# Altium schematic sheet Signal_distribution.SchDoc: =ProjectName
size 420 x 297 mm; Author: SBH; CompanyName: WUT; DrawnBy: SBH; Organization: ISE-WUT; Address1: Warsaw Univeristy of Technology; Address2: Nowowiejska 15/19; DocumentNumber: 6; Revision: -; SheetNumber: 6; SheetTotal: 12; EDA_Number: ARTIQ; Projet: eRTM15 Baikal; ModifiedBy: -; CreateDate: XX/XX/XXXX; CheckedDate: -; Title2: Signal_distribution.SchDoc; DivGrp: ISE; Designer: SBH; ModifiedDate: -; ProjectName: eRTM15 Baikal
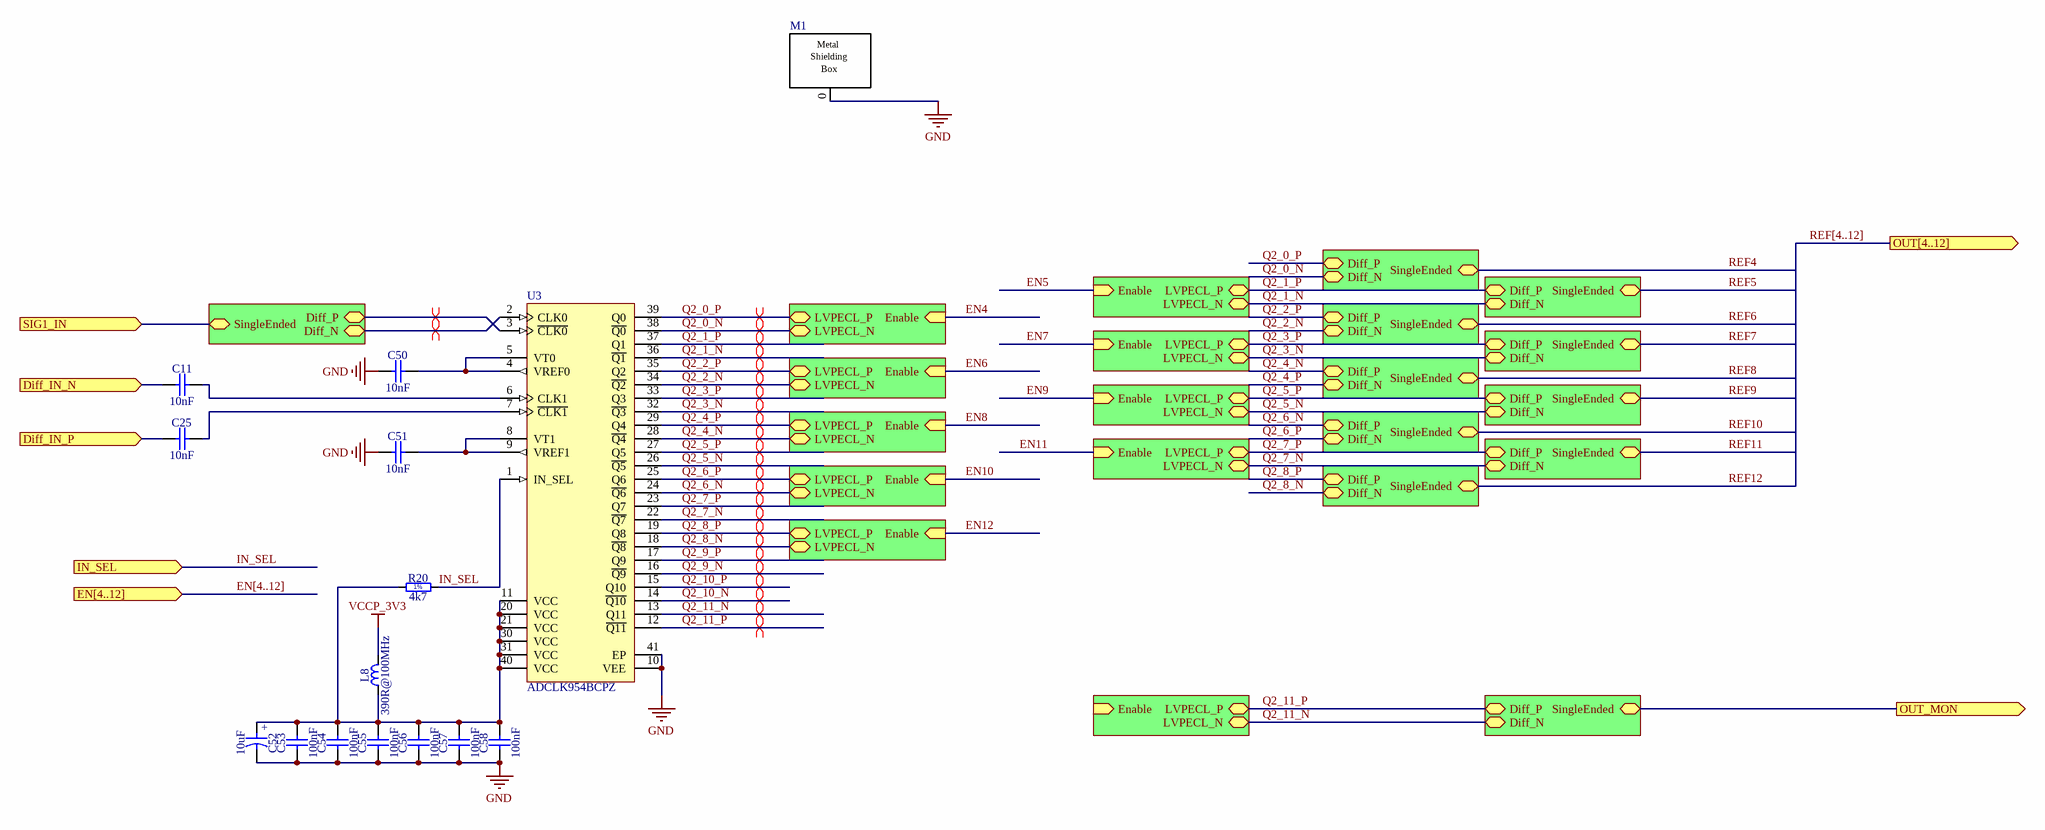
[diagram p0: Signal_distribution.SchDoc]

## Parts
C11  10nF  [CAPC1005X55N]
C25  10nF  [CAPC1005X55N]
C50  10nF  [CAPC1005X55N]
C51  10nF  [CAPC1005X55N]
C52  10uF  [CAPMP3216X180N]
C53  100nF  [CAPC1005X55N]
C54  100nF  [CAPC1005X55N]
C55  100nF  [CAPC1005X55N]
C56  100nF  [CAPC1005X55N]
C57  100nF  [CAPC1005X55N]
C58  100nF  [CAPC1005X55N]
L8  390R@100MHz  [INDC1608X95N]
M1  Shield  [BMI-S-202-F]  (value not drawn)
R20  4k7  [RESC1005X40N]
U3  ADCLK954BCPZ  [ADI-CP-40-8_M]

## Sub-sheets
U_Diff2SE = Diff2SE.SchDoc: Diff_P, Diff_N, SingleEnded
U_Diff2SE = Diff2SE.SchDoc: Diff_P, Diff_N, SingleEnded
U_Diff2SE = Diff2SE.SchDoc: Diff_P, Diff_N, SingleEnded
U_Diff2SE = Diff2SE.SchDoc: Diff_P, Diff_N, SingleEnded
U_Diff2SE = Diff2SE.SchDoc: Diff_P, Diff_N, SingleEnded
U_Diff2SE = Diff2SE.SchDoc: Diff_P, Diff_N, SingleEnded
U_Diff2SE = Diff2SE.SchDoc: Diff_P, Diff_N, SingleEnded
U_Diff2SE = Diff2SE.SchDoc: Diff_P, Diff_N, SingleEnded
U_Diff2SE = Diff2SE.SchDoc: Diff_P, Diff_N, SingleEnded
U_Diff2SE = Diff2SE.SchDoc: Diff_P, Diff_N, SingleEnded
U_Diff2SE = Diff2SE.SchDoc: Diff_P, Diff_N, SingleEnded
U_LvpeclTermWithCtrl = LvpeclTermWithCtrl.SchDoc: LVPECL_P (bidir), LVPECL_N (bidir), Enable (in)
U_LvpeclTermWithCtrl = LvpeclTermWithCtrl.SchDoc: LVPECL_P (bidir), LVPECL_N (bidir), Enable (in)
U_LvpeclTermWithCtrl = LvpeclTermWithCtrl.SchDoc: LVPECL_P (bidir), LVPECL_N (bidir), Enable (in)
U_LvpeclTermWithCtrl = LvpeclTermWithCtrl.SchDoc: LVPECL_P (bidir), LVPECL_N (bidir), Enable (in)
U_LvpeclTermWithCtrl = LvpeclTermWithCtrl.SchDoc: LVPECL_P (bidir), LVPECL_N (bidir), Enable (in)
U_LvpeclTermWithCtrl = LvpeclTermWithCtrl.SchDoc: LVPECL_P (bidir), LVPECL_N (bidir), Enable (in)
U_LvpeclTermWithCtrl = LvpeclTermWithCtrl.SchDoc: LVPECL_P (bidir), LVPECL_N (bidir), Enable (in)
U_LvpeclTermWithCtrl = LvpeclTermWithCtrl.SchDoc: LVPECL_P (bidir), LVPECL_N (bidir), Enable (in)
U_LvpeclTermWithCtrl = LvpeclTermWithCtrl.SchDoc: LVPECL_P (bidir), LVPECL_N (bidir), Enable (in)
U_LvpeclTermWithCtrl = LvpeclTermWithCtrl.SchDoc: LVPECL_P (bidir), LVPECL_N (bidir), Enable (in)

## Ports
Diff_IN_N (in), Diff_IN_P (in), EN[4..12] (in), IN_SEL (in), OUT[4..12] (out), OUT_MON (out), SIG1_IN (in)

## Nets
GND: C50.1 C51.1 C52.2 C53.1 C54.1 C55.1 C56.1 C57.1 C58.1 M1.0(SHIELD) U3.10(VEE) U3.41(EP)
VCCP_3V3: L8.2
Diff_IN_N: C11.1 ; port Diff_IN_N
Diff_IN_P: C25.1 ; port Diff_IN_P
EN4: sheet U_LvpeclTermWithCtrl/Enable
EN5: sheet U_LvpeclTermWithCtrl/Enable
EN6: sheet U_LvpeclTermWithCtrl/Enable
EN7: sheet U_LvpeclTermWithCtrl/Enable
EN8: sheet U_LvpeclTermWithCtrl/Enable
EN9: sheet U_LvpeclTermWithCtrl/Enable
EN10: sheet U_LvpeclTermWithCtrl/Enable
EN11: sheet U_LvpeclTermWithCtrl/Enable
EN12: sheet U_LvpeclTermWithCtrl/Enable
IN_SEL: R20.2 U3.1(IN_SEL) ; port IN_SEL
OUT_MON: port OUT_MON, sheet U_Diff2SE/SingleEnded
Q2_0_N: U3.38(~{Q0}) ; sheet U_Diff2SE/Diff_N, sheet U_LvpeclTermWithCtrl/LVPECL_N
Q2_0_P: U3.39(Q0) ; sheet U_Diff2SE/Diff_P, sheet U_LvpeclTermWithCtrl/LVPECL_P
Q2_1_N: U3.36(~{Q1}) ; sheet U_Diff2SE/Diff_N, sheet U_LvpeclTermWithCtrl/LVPECL_N
Q2_1_P: U3.37(Q1) ; sheet U_Diff2SE/Diff_P, sheet U_LvpeclTermWithCtrl/LVPECL_P
Q2_2_N: U3.34(~{Q2}) ; sheet U_Diff2SE/Diff_N, sheet U_LvpeclTermWithCtrl/LVPECL_N
Q2_2_P: U3.35(Q2) ; sheet U_Diff2SE/Diff_P, sheet U_LvpeclTermWithCtrl/LVPECL_P
Q2_3_N: U3.32(~{Q3}) ; sheet U_Diff2SE/Diff_N, sheet U_LvpeclTermWithCtrl/LVPECL_N
Q2_3_P: U3.33(Q3) ; sheet U_Diff2SE/Diff_P, sheet U_LvpeclTermWithCtrl/LVPECL_P
Q2_4_N: U3.28(~{Q4}) ; sheet U_Diff2SE/Diff_P, sheet U_LvpeclTermWithCtrl/LVPECL_N
Q2_4_P: U3.29(Q4) ; sheet U_Diff2SE/Diff_N, sheet U_LvpeclTermWithCtrl/LVPECL_P
Q2_5_N: U3.26(~{Q5}) ; sheet U_Diff2SE/Diff_N, sheet U_LvpeclTermWithCtrl/LVPECL_N
Q2_5_P: U3.27(Q5) ; sheet U_Diff2SE/Diff_P, sheet U_LvpeclTermWithCtrl/LVPECL_P
Q2_6_N: U3.24(~{Q6}) ; sheet U_Diff2SE/Diff_P, sheet U_LvpeclTermWithCtrl/LVPECL_N
Q2_6_P: U3.25(Q6) ; sheet U_Diff2SE/Diff_N, sheet U_LvpeclTermWithCtrl/LVPECL_P
Q2_7_N: U3.22(~{Q7}) ; sheet U_Diff2SE/Diff_N, sheet U_LvpeclTermWithCtrl/LVPECL_N
Q2_7_P: U3.23(Q7) ; sheet U_Diff2SE/Diff_P, sheet U_LvpeclTermWithCtrl/LVPECL_P
Q2_8_N: U3.18(~{Q8}) ; sheet U_Diff2SE/Diff_N, sheet U_LvpeclTermWithCtrl/LVPECL_N
Q2_8_P: U3.19(Q8) ; sheet U_Diff2SE/Diff_P, sheet U_LvpeclTermWithCtrl/LVPECL_P
Q2_9_N: U3.16(~{Q9})
Q2_9_P: U3.17(Q9)
Q2_10_N: U3.14(~{Q10})
Q2_10_P: U3.15(Q10)
Q2_11_N: U3.13(Q11) ; sheet U_Diff2SE/Diff_N, sheet U_LvpeclTermWithCtrl/LVPECL_N
Q2_11_P: U3.12(~{Q11}) ; sheet U_Diff2SE/Diff_P, sheet U_LvpeclTermWithCtrl/LVPECL_P
REF4: sheet U_Diff2SE/SingleEnded
REF5: sheet U_Diff2SE/SingleEnded
REF6: sheet U_Diff2SE/SingleEnded
REF7: sheet U_Diff2SE/SingleEnded
REF8: sheet U_Diff2SE/SingleEnded
REF9: sheet U_Diff2SE/SingleEnded
REF10: sheet U_Diff2SE/SingleEnded
REF11: sheet U_Diff2SE/SingleEnded
REF12: sheet U_Diff2SE/SingleEnded
SIG1_IN: port SIG1_IN, sheet U_Diff2SE/SingleEnded
NetC11_2: C11.2 U3.6(CLK1)
NetC25_2: C25.2 U3.7(~{CLK1})
NetC50_2: C50.2 U3.4(VREF0) U3.5(VT0)
NetC51_2: C51.2 U3.8(VT1) U3.9(VREF1)
NetC52_1: C52.1 C53.2 C54.2 C55.2 C56.2 C57.2 C58.2 L8.1 R20.1 U3.11(VCC) U3.20(VCC) U3.21(VCC) U3.30(VCC) U3.31(VCC) U3.40(VCC)
NetU3_2: U3.2(CLK0) ; sheet U_Diff2SE/Diff_N
NetU3_3: U3.3(~{CLK0}) ; sheet U_Diff2SE/Diff_P

## Buses and harness runs
bus EN[4..12] = port EN[4..12]
bus REF[4..12] = port OUT[4..12]

## Layout directives
differential pair: NetU3_2, NetU3_3, Q2_0_N, Q2_0_P, Q2_1_N, Q2_1_P, Q2_2_N, Q2_2_P, Q2_3_N, Q2_3_P, Q2_4_N, Q2_4_P, Q2_5_N, Q2_5_P, Q2_6_N, Q2_6_P, Q2_7_N, Q2_7_P, Q2_8_N, Q2_8_P, Q2_9_N, Q2_9_P, Q2_10_N, Q2_10_P, Q2_11_N, Q2_11_P

## Notes on the sheet
- Project/Equipment
- Document
- Designer
- Drawn by
- Check.by
- File
- Last Mod.
- Print Date
- Sheet
- Size
- A3
- of
- Rev
- (in symbol BMI-S-202-F) Metal; Shielding; Box
- (in symbol CTE3216-18_10UF_10V_10%_LESR1800) +
- (in symbol R0402_4K7_1%_0.0625W_100PPM) 1%

## Library data of the parts
C11 C25 C50 C51 = CC0402_10NF_16V_10%_X7R: Non-polarised capacitor; Part Description: SMD Multilayer Chip Ceramic Capacitor; Manufacturer: GENERIC; Manufacturer1 Part Number: 223878715636; Voltage: 16V; TC: X7R; Tolerance: ±10%; Part Number: CC0402_10NF_16V_10%_X7R; Component Kind: Standard; Component Type: Standard; Pin Count: 2; Value: 10nF; Status: Not Recommended; Manufacturer Part Number: CC0402_10NF_16V_10%_X7R; Case: 0402; Mounted: Yes; Socket: No; SMD: Yes; Sense: No; Manufacturer1 Example: PHYCOMP; Manufacturer1 ComponentHeight: 0.55mm; HelpURL: \\cern.ch\dfs\Applications\Altium\Datasheets\CC0402_X7R_PHYCOMP.pdf; Author: CERN DEM JLC; CreateDate: 2007-12-03; LatestRevisionDate: 2007-12-03
C52 = CTE3216-18_10UF_10V_10%_LESR1800: Polarised capacitor; Part Description: Low ESR 1R8 Solid Tantalum Chip Capacitor; Manufacturer: GENERIC; Manufacturer1 Part Number: TPSA106K010R1800; Voltage: 10V; Tolerance: ±10%; Part Number: CTE3216-18_10UF_10V_10%_LESR1800; Component Kind: Standard; Component Type: Standard; Pin Count: 2; Value: 10uF; Status: Preferred; Manufacturer Part Number: CTE3216-18_10UF_10V_10%_LESR1800; Case: A; Mounted: Yes; Socket: No; SMD: Yes; Sense: No; Manufacturer1 Example: AVX; Manufacturer1 ComponentHeight: 1.8mm; HelpURL: \\cern.ch\dfs\Applications\Altium\Datasheets\CTE-LESR_AVX_TPS.pdf; Author: CERN DEM JLC; CreateDate: 2008-05-05; LatestRevisionDate: 2009-01-20
C53-C58 = CC0402_100NF_16V_10%_X7R: Non-polarised capacitor; Part Description: SMD Multilayer Chip Ceramic Capacitor; Manufacturer: GENERIC; Manufacturer1 Part Number: GRM155R71C104KA88D; Voltage: 16V; TC: X7R; Tolerance: ±10%; Part Number: CC0402_100NF_16V_10%_X7R; Component Kind: Standard; Component Type: Standard; Pin Count: 2; Value: 100nF; Status: Not Recommended; Manufacturer Part Number: CC0402_100NF_16V_10%_X7R; Case: 0402; Mounted: Yes; Socket: No; SMD: Yes; Sense: No; Manufacturer1 Example: MURATA; Manufacturer1 ComponentHeight: 0.55mm; HelpURL: \\cern.ch\dfs\Applications\Altium\Datasheets\CC0402_X7R_MURATA_GRM.pdf; Author: CERN DEM JLC; CreateDate: 2013-12-05; LatestRevisionDate: 2007-12-03
L8 = IND0603_TDK_MPZ1608R391A: Inductor; Part Description: SMT Chip Bead for Power Line; Manufacturer: TDK; Power: 1.2A; Resistance: 0.12R; Tolerance: ±25%; Part Number: IND0603_TDK_MPZ1608R391A; Component Kind: Standard; Component Type: Standard; Pin Count: 2; Value: 390R@100MHz; Status: None; Manufacturer Part Number: MPZ1608R391A; Case: 0603; Mounted: Yes; Socket: No; SMD: Yes; Sense: No; ComponentHeight: 0.95mm; HelpURL: \\cern.ch\dfs\Applications\Altium\Datasheets\IND0603_TDK_MPZ1608.pdf; Author: CERN DEM JLC; CreateDate: 2009-12-02; LatestRevisionDate: 2009-12-02
M1 = BMI-S-202-F: STANDARD SURFACE MOUNT SHIELD  TWO-PIECE PART NO. BMI-S-202; Manufacturer: Laird Technologies; Remark: part 1 - gasket, part 2 - cover; Manufacturer part name: BMI-S-202-F; Supplier: Mouser; Mounting type: SMT; Supplier part 1 number: 739-BMIS-202-F; Supplier part 2 number: 739-BMIS-202-C
R20 = R0402_4K7_1%_0.0625W_100PPM: Resistor - 1%; Part Description: General Purpose Thick Film Chip Resistor; Manufacturer: GENERIC; Manufacturer1 Part Number: 232270674702L; TC: ±100ppm/°C; Part Number: R0402_4K7_1%_0.0625W_100PPM; Component Kind: Standard; Component Type: Standard; Pin Count: 2; Value: 4k7; Status: Not recommended; Power: 0.0625W; Tolerance: ±1%; Manufacturer Part Number: R0402_4K7_1%_0.0625W_100PPM; Case: 0402; Mounted: Yes; Sense: No; Socket: No; SMD: Yes; Manufacturer1 Example: YAGEO PHYCOMP; Manufacturer1 ComponentHeight: 0.4mm; HelpURL: \\cern.ch\dfs\Applications\Altium\Datasheets\R0402_Phycomp_RC0402.pdf; Author: CERN DEM JLC; CreateDate: 2007-12-03; LatestRevisionDate: 2012-10-17
U3 = CMP-0884-00036-1: 2 Selectable Inputs, 12 LVPECL Outputs, SiGe Clock Fanout Buffer, 3.3 V Supply, Industrial, 40-pin QFN (CP-40-8), Tray; Manufacturer: Analog Devices; Supply Voltage (V): 3.3; # of Outputs: 12; On-Chip VCO or DCO: No; Max f-out: 4.8 GHz; # of Inputs: 2; I/O Interface: Pin Select; PackageVersion: 082708-A, 08/2008; DatasheetVersion: Rev. B; Output Logic: LVPECL; PackageReference: CP-40-8; Mounting Technology: Surface Mount; ComponentLink1Description: Manufacturer URL; ComponentLink2Description: Datasheet; ComponentLink4URL: http://www.analog.com/en/clock-and-timing/clock-generation-and-distribution/adclk954/products/product.html; Code_JEDEC: MO-220-VJJD-2; ComponentLink2URL: http://www.analog.com/static/imported-files/data_sheets/ADCLK954.pdf; ComponentLink1URL: http://www.analog.com/en/index.html; ComponentLink4Description: Product URL; PartNumber: ADCLK954BCPZ; ComponentLink3URL: http:/www.analog.com/static/imported-files/packages/PKG_PDF/LFCSP(CP)/CP_40_8.pdf; PackageDescription: 40-Pin Lead Frame Chip Scale Package, Body 6 x 6 mm, Pitch 0.5 mm; Packing: Tray; ComponentLink3Description: Package Specification